# Altium schematic sheet HV-Connectors.SchDoc
size A; SheetNumber: 3; SheetTotal: 8
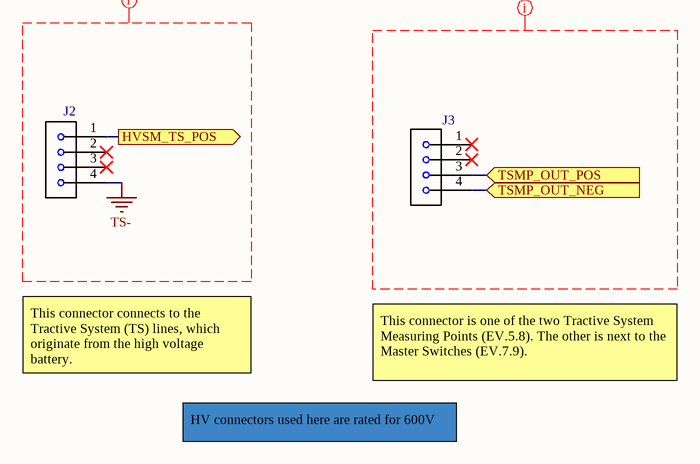
[diagram p0: HV-Connectors.SchDoc]

## Parts
J2  Conn-Molex-43045-0400  [FOOTPRINT-MOLEX-43045-0400]  (value not drawn)
J3  Conn-Molex-43045-0400  [FOOTPRINT-MOLEX-43045-0400]  (value not drawn)

## Ports
HVSM_TS_POS (out, see Top_Level[1B], HV-Trigger[1A], TSMP-Resistors[3B]), TSMP_OUT_NEG (in, see Top_Level[1C], TSMP-Resistors[2B]), TSMP_OUT_POS (in, see Top_Level[1C], TSMP-Resistors[2B])

## Nets
TS-: J2.4
HVSM_TS_POS: J2.1 ; port HVSM_TS_POS
TSMP_OUT_NEG: J3.4 ; port TSMP_OUT_NEG
TSMP_OUT_POS: J3.3 ; port TSMP_OUT_POS

Not connected (* = marked no-connect by the designer): J2 2* 3*; J3 1* 2*

## Layout directives
mark named TS Connections: TS-
mark named TSMP: (no net found under the mark)

## Notes on the sheet
- This connector connects to the Tractive System (TS) lines, which originate from the high voltage battery.
- This connector is one of the two Tractive System Measuring Points (EV.5.8). The other is next to the Master Switches (EV.7.9).
- HV connectors used here are rated for 600V

## Library data of the parts
J2 J3 = CMP-035-000005-2: Microfit RA 4ckt Std/Econ; MF: Molex; MP: 43045-0400; SnapEDA_Link: https://www.snapeda.com/parts/43045-0400/Molex/view-part/?ref=snap; Value: *; Price: None; Design Item ID: Conn-Molex-43045-0400; Package: None; Source: Connectors.SchLib; Availability: Unavailable